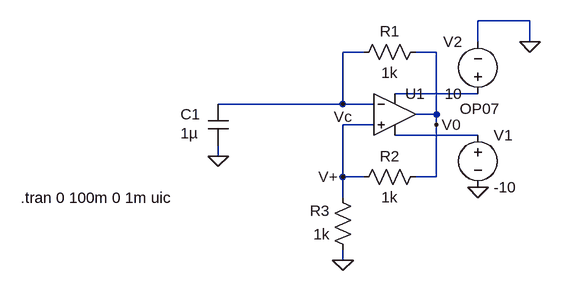
[diagram p0: schematic real_rc_osc.asc]
real_rc_osc.asc, the LTspice schematic file:
Version 4
SHEET 1 880 680
WIRE 480 0 400 0
WIRE 400 32 400 0
WIRE 480 32 480 0
WIRE 224 48 192 48
WIRE 336 48 304 48
WIRE 400 112 272 112
WIRE 192 128 192 48
WIRE 192 128 0 128
WIRE 240 128 192 128
WIRE 336 144 336 48
WIRE 336 144 304 144
WIRE 240 160 192 160
WIRE 336 160 336 144
WIRE 400 176 272 176
WIRE 0 208 0 192
WIRE 192 240 192 160
WIRE 224 240 192 240
WIRE 336 240 336 160
WIRE 336 240 304 240
WIRE 192 272 192 240
WIRE 192 368 192 352
FLAG 192 368 0
FLAG 0 208 0
FLAG 336 160 V0
FLAG 192 128 Vc
FLAG 192 240 V+
FLAG 480 32 0
FLAG 400 256 0
SYMBOL res 320 32 R90
WINDOW 0 0 56 VBottom 2
WINDOW 3 32 56 VTop 2
SYMATTR InstName R1
SYMATTR Value 1k
SYMBOL res 320 224 R90
WINDOW 0 0 56 VBottom 2
WINDOW 3 32 56 VTop 2
SYMATTR InstName R2
SYMATTR Value 1k
SYMBOL res 208 368 R180
WINDOW 0 36 76 Left 2
WINDOW 3 36 40 Left 2
SYMATTR InstName R3
SYMATTR Value 1k
SYMBOL cap -16 128 R0
WINDOW 0 -42 16 Left 2
WINDOW 3 -42 45 Left 2
SYMATTR InstName C1
SYMATTR Value 1µ
SYMBOL OpAmps\\OP07 272 80 R0
WINDOW 3 100 55 Left 2
SYMATTR InstName U1
SYMBOL voltage 400 160 R0
WINDOW 123 0 0 Left 0
WINDOW 39 0 0 Left 0
SYMATTR InstName V1
SYMATTR Value -10
SYMBOL voltage 400 128 R180
WINDOW 0 24 96 Left 2
WINDOW 3 24 16 Left 2
WINDOW 123 0 0 Left 0
WINDOW 39 0 0 Left 0
SYMATTR InstName V2
SYMATTR Value 10
TEXT -304 272 Left 2 !.tran 0 100m 0 1m uic

The netlist it stands for:
* real_rc_osc.asc
R1 V0 Vc 1k
R2 V0 V+ 1k
R3 0 V+ 1k
C1 Vc 0 1µ
XU1 V+ Vc N001 N002 V0 LT1001  ; OP07, pins In+ In- V+ V- OUT
V1 N002 0 -10
V2 N001 0 10
.tran 0 100m 0 1m uic
.lib LTC.lib
.backanno
.end

* Results of the author's LTspice run, read from the files saved beside the schematic
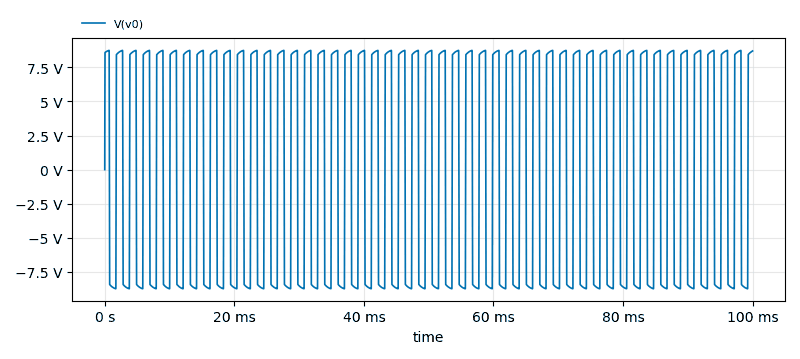
[diagram p1: Transient Analysis of real_rc_osc.asc, plotted from the saved traces]
* Transient Analysis, 1 run:
*   V(v0): min -8.75 V, max 8.749 V, average 33.29 mV, rms 8.427 V, last 8.705 V